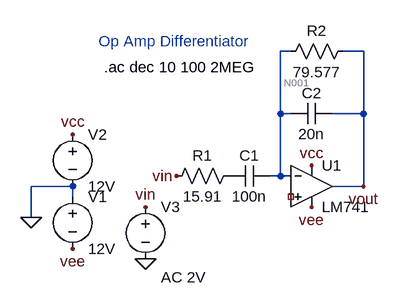
[diagram p0: schematic op_amp_differentiator_2.asc]
op_amp_differentiator_2.asc, the LTspice schematic file:
Version 4.1
SHEET 1 880 680
WIRE 368 -32 352 -32
WIRE 480 -32 448 -32
WIRE 352 64 352 -32
WIRE 368 64 352 64
WIRE 480 64 480 -32
WIRE 480 64 432 64
WIRE 352 160 352 64
WIRE 352 160 336 160
WIRE 368 160 352 160
WIRE 32 176 -32 176
WIRE 480 176 480 64
WIRE 480 176 432 176
WIRE 32 192 32 176
WIRE -32 224 -32 176
FLAG -32 224 0
FLAG 400 144 vcc
FLAG 32 96 vcc
FLAG 32 272 vee
FLAG 400 208 vee
FLAG 192 160 vin
FLAG 144 208 vin
FLAG 144 288 0
FLAG 480 176 vout
SYMBOL voltage 32 176 R0
WINDOW 123 0 0 Left 0
WINDOW 39 0 0 Left 0
SYMATTR InstName V1
SYMATTR Value 12V
SYMBOL voltage 32 80 R0
WINDOW 123 0 0 Left 0
WINDOW 39 0 0 Left 0
SYMATTR InstName V2
SYMATTR Value 12V
SYMBOL LM741 400 112 R0
SYMATTR InstName U1
SYMBOL res 288 144 R90
WINDOW 0 0 56 VBottom 2
WINDOW 3 32 56 VTop 2
SYMATTR InstName R1
SYMATTR Value 15.91
SYMBOL res 464 -48 R90
WINDOW 0 0 56 VBottom 2
WINDOW 3 32 56 VTop 2
SYMATTR InstName R2
SYMATTR Value 79.577
SYMBOL cap 336 144 R90
WINDOW 0 0 32 VBottom 2
WINDOW 3 32 32 VTop 2
SYMATTR InstName C1
SYMATTR Value 100n
SYMBOL cap 432 48 R90
WINDOW 0 0 32 VBottom 2
WINDOW 3 32 32 VTop 2
SYMATTR InstName C2
SYMATTR Value 20n
SYMBOL voltage 144 192 R0
WINDOW 123 24 124 Left 2
WINDOW 39 0 0 Left 0
SYMATTR InstName V3
SYMATTR Value ""
SYMATTR Value2 AC 2V
TEXT 72 -48 Left 2 ;Op Amp Differentiator
TEXT 80 -8 Left 2 !.ac dec 10 100 2MEG

The netlist it stands for:
* op_amp_differentiator_2.asc
V1 0 vee 12V
V2 vcc 0 12V
X§U1 NC_01 N001 vcc vee vout LM741  ; pins In+ In- V+ V- OUT
R1 P001 vin 15.91
R2 vout N001 79.577
C1 N001 P001 100n
C2 vout N001 20n
V3 vin 0 AC 2V
* Op Amp Differentiator
.ac dec 10 100 2MEG
.lib LM741.lib
.backanno
.end

* Results of the author's LTspice run, read from the files saved beside the schematic
* Operating Point, zero values left out:
*   V(vcc) = 12 V
*   V(n001) = -11 V
*   V(vout) = -11 V
*   V(vee) = -12 V
*   I(V1) = -1.592 mA
*   I(R2) = 159.7 nA
*   I(V2) = -1.592 mA
*   Ix(u1:2) = 159.7 nA
*   Ix(u1:99) = 1.592 mA
*   Ix(u1:50) = -1.592 mA
*   Ix(u1:28) = -159.7 nA
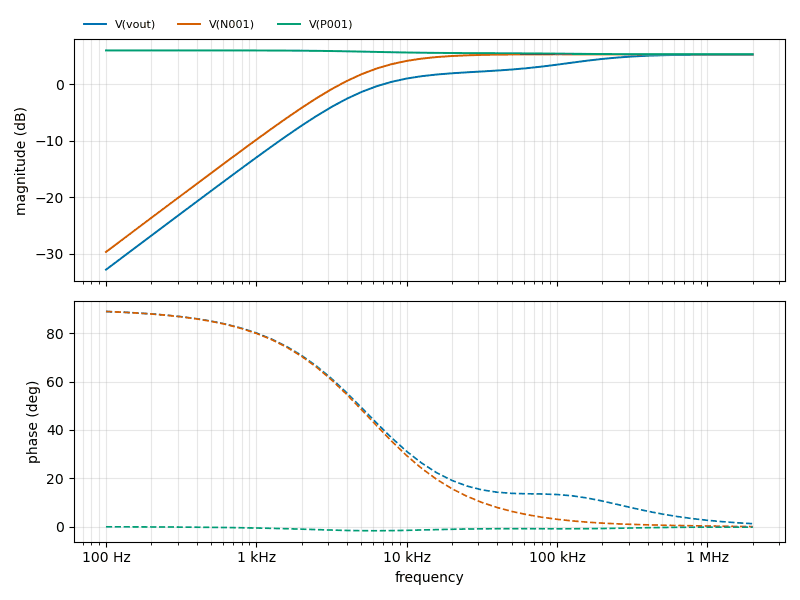
[diagram p1: AC Analysis of op_amp_differentiator_2.asc, plotted from the saved traces]
* AC Analysis, 1 run:
*   V(vout): -32.81 dB at 100 Hz, 5.30 dB at 2 MHz, peak 5.30 dB at 2 MHz, 3 dB below the peak at 31.81 kHz
*   V(N001): -29.66 dB at 100 Hz, 5.32 dB at 2 MHz, peak 5.33 dB at 100 kHz, 3 dB below the peak at 5.63 kHz
*   V(P001): 6.02 dB at 100 Hz, 5.32 dB at 2 MHz, peak 6.02 dB at 100 Hz